# EAGLE design trs80_m2 (EAGLE 9.6.2)
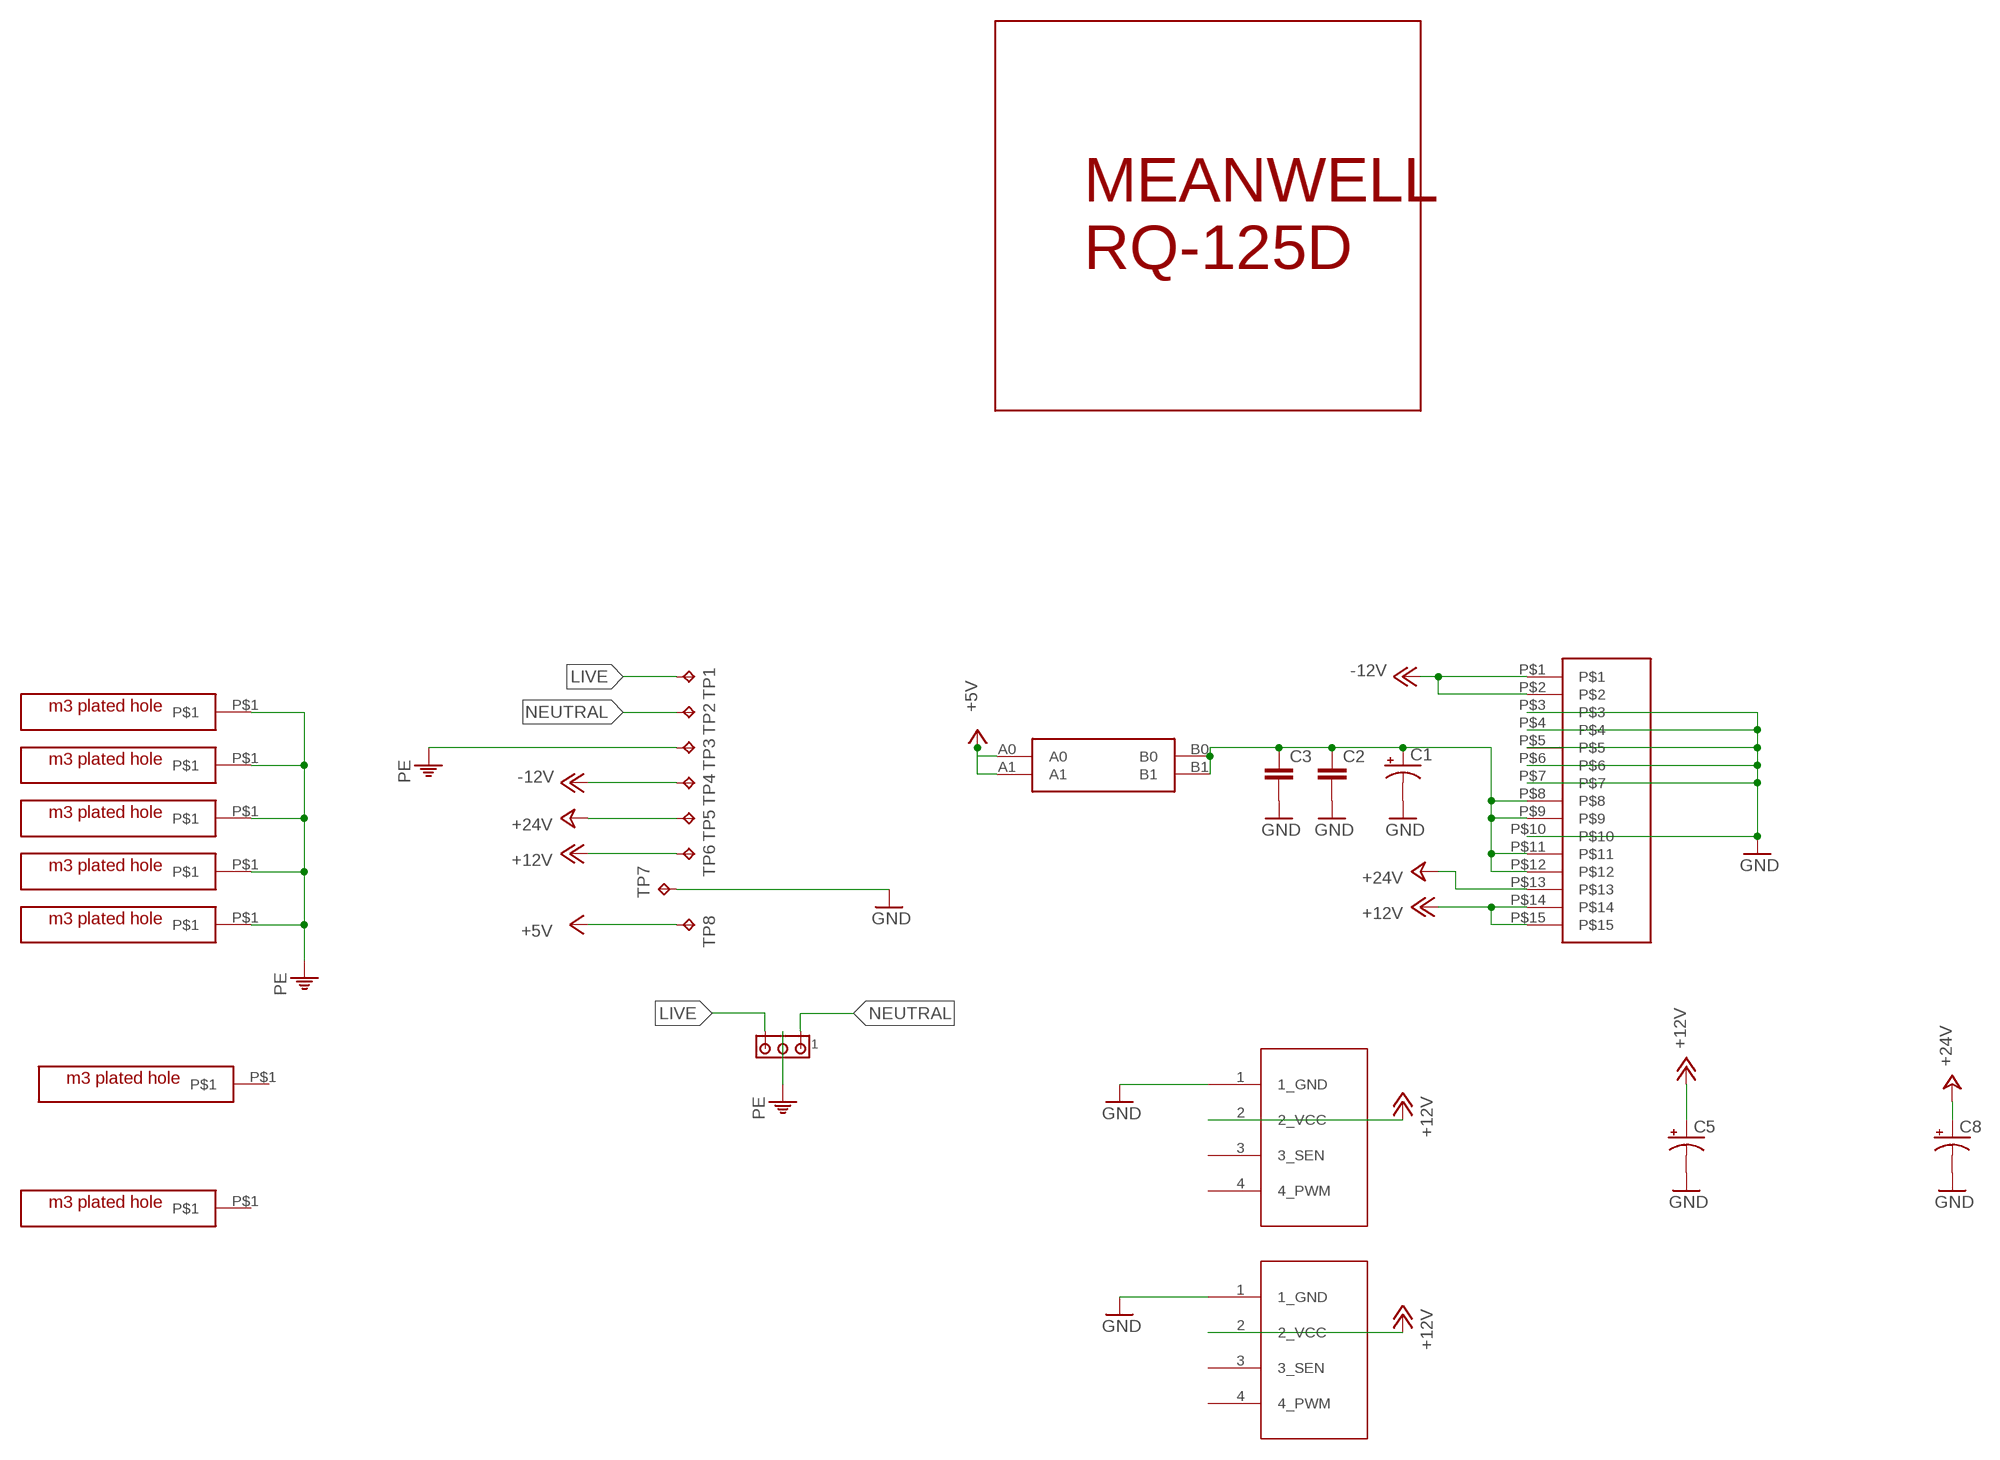
[diagram p0: schematic, sheet 1]

## Parts
C1  CPOL-USE3.5-8  [E3,5-8]
C2  C5/2.5  [C5B2.5]
C3  C5/2.5  [C5B2.5]
C5  CPOL-USE3.5-8  [E3,5-8]
C8  CPOL-USE3.5-8  [E3,5-8]
J1  350760-4  [350760-4]
JP1  4PIN_FAN  [1X04]
JP4  4PIN_FAN  [1X04]
TP1  TPPAD1-20Y  [P1-20Y]
TP2  TPPAD1-20Y  [P1-20Y]
TP3  TPPAD1-20Y  [P1-20Y]
TP4  TPPAD1-20Y  [P1-20Y]
TP5  TPPAD1-20Y  [P1-20Y]
TP6  TPPAD1-20Y  [P1-20Y]
TP7  TPPAD1-20Y  [P1-20Y]
TP8  TPPAD1-20Y  [P1-20Y]
U$2  MEANWELL_RQ_125D  [MEANWELL_RQ125D]
U$3  TE_3X5  [TRS80M2_3X5]
U$4  M3_HOLE_PLATED  [M3_HOLE_PLATED]
U$5  M3_HOLE_PLATED  [M3_HOLE_PLATED]
U$6  M3_HOLE_PLATED  [M3_HOLE_PLATED]
U$7  M3_HOLE_PLATED  [M3_HOLE_PLATED]
U$8  M3_HOLE_PLATED  [M3_HOLE_PLATED]
U$9  CAR_FUSE_HOLDER3IN1  [FUSE_HOLDER_3IN1]
U$10  M3_HOLE_PLATED  [M3_HOLE_PLATED]
U$11  M3_HOLE_PLATED  [M3_HOLE_PLATED]

## Nets
+5V: TP8.TP U$9.A0 U$9.A1
+12V: C5.+ JP1.2(2_VCC) JP4.2(2_VCC) TP6.TP U$3.P$14 U$3.P$15
+24V: C8.+ TP5.TP U$3.P$13
-12V: TP4.TP U$3.P$1 U$3.P$2
GND: C1.- C2.2 C3.2 C5.- C8.- JP1.1(1_GND) JP4.1(1_GND) TP7.TP U$3.P$3 U$3.P$4 U$3.P$5 U$3.P$6 U$3.P$7 U$3.P$10
LIVE: J1.3 TP1.TP
N$2: C1.+ C2.1 C3.1 U$3.P$8 U$3.P$9 U$3.P$11 U$3.P$12 U$9.B0 U$9.B1
NEUTRAL: J1.1 TP2.TP
PE: J1.2 TP3.TP U$4.P$1 U$5.P$1 U$6.P$1 U$7.P$1 U$8.P$1
Unconnected: JP1.3(3_SEN) JP1.4(4_PWM) JP4.3(3_SEN) JP4.4(4_PWM) U$10.P$1 U$11.P$1

## Library data of the parts
C1 C5 C8 = adafruit_changed:CPOL-US: POLARIZED CAPACITOR, American symbol
C2 C3 = capacitor-wima:C: CAPACITOR naming: grid - package width
J1 = con-amp:350760-4: Universal MATE-N-LOK .250" Centerline, 600 V, 19 - 36 A max Source: http://catalog.tycoelectronics.com/ .. ENG_CD_350760_T.pdf
JP1 JP4 = appleii:4PIN_FAN: PIN HEADER
TP1-TP8 = testpad:TP: Test pad
U$2 = os1:MEANWELL_RQ_125D
U$3 = os1:TE_3X5
U$4-U$8 U$10 U$11 = os1:M3_HOLE_PLATED
U$9 = atx_power_control:CAR_FUSE_HOLDER

## Board
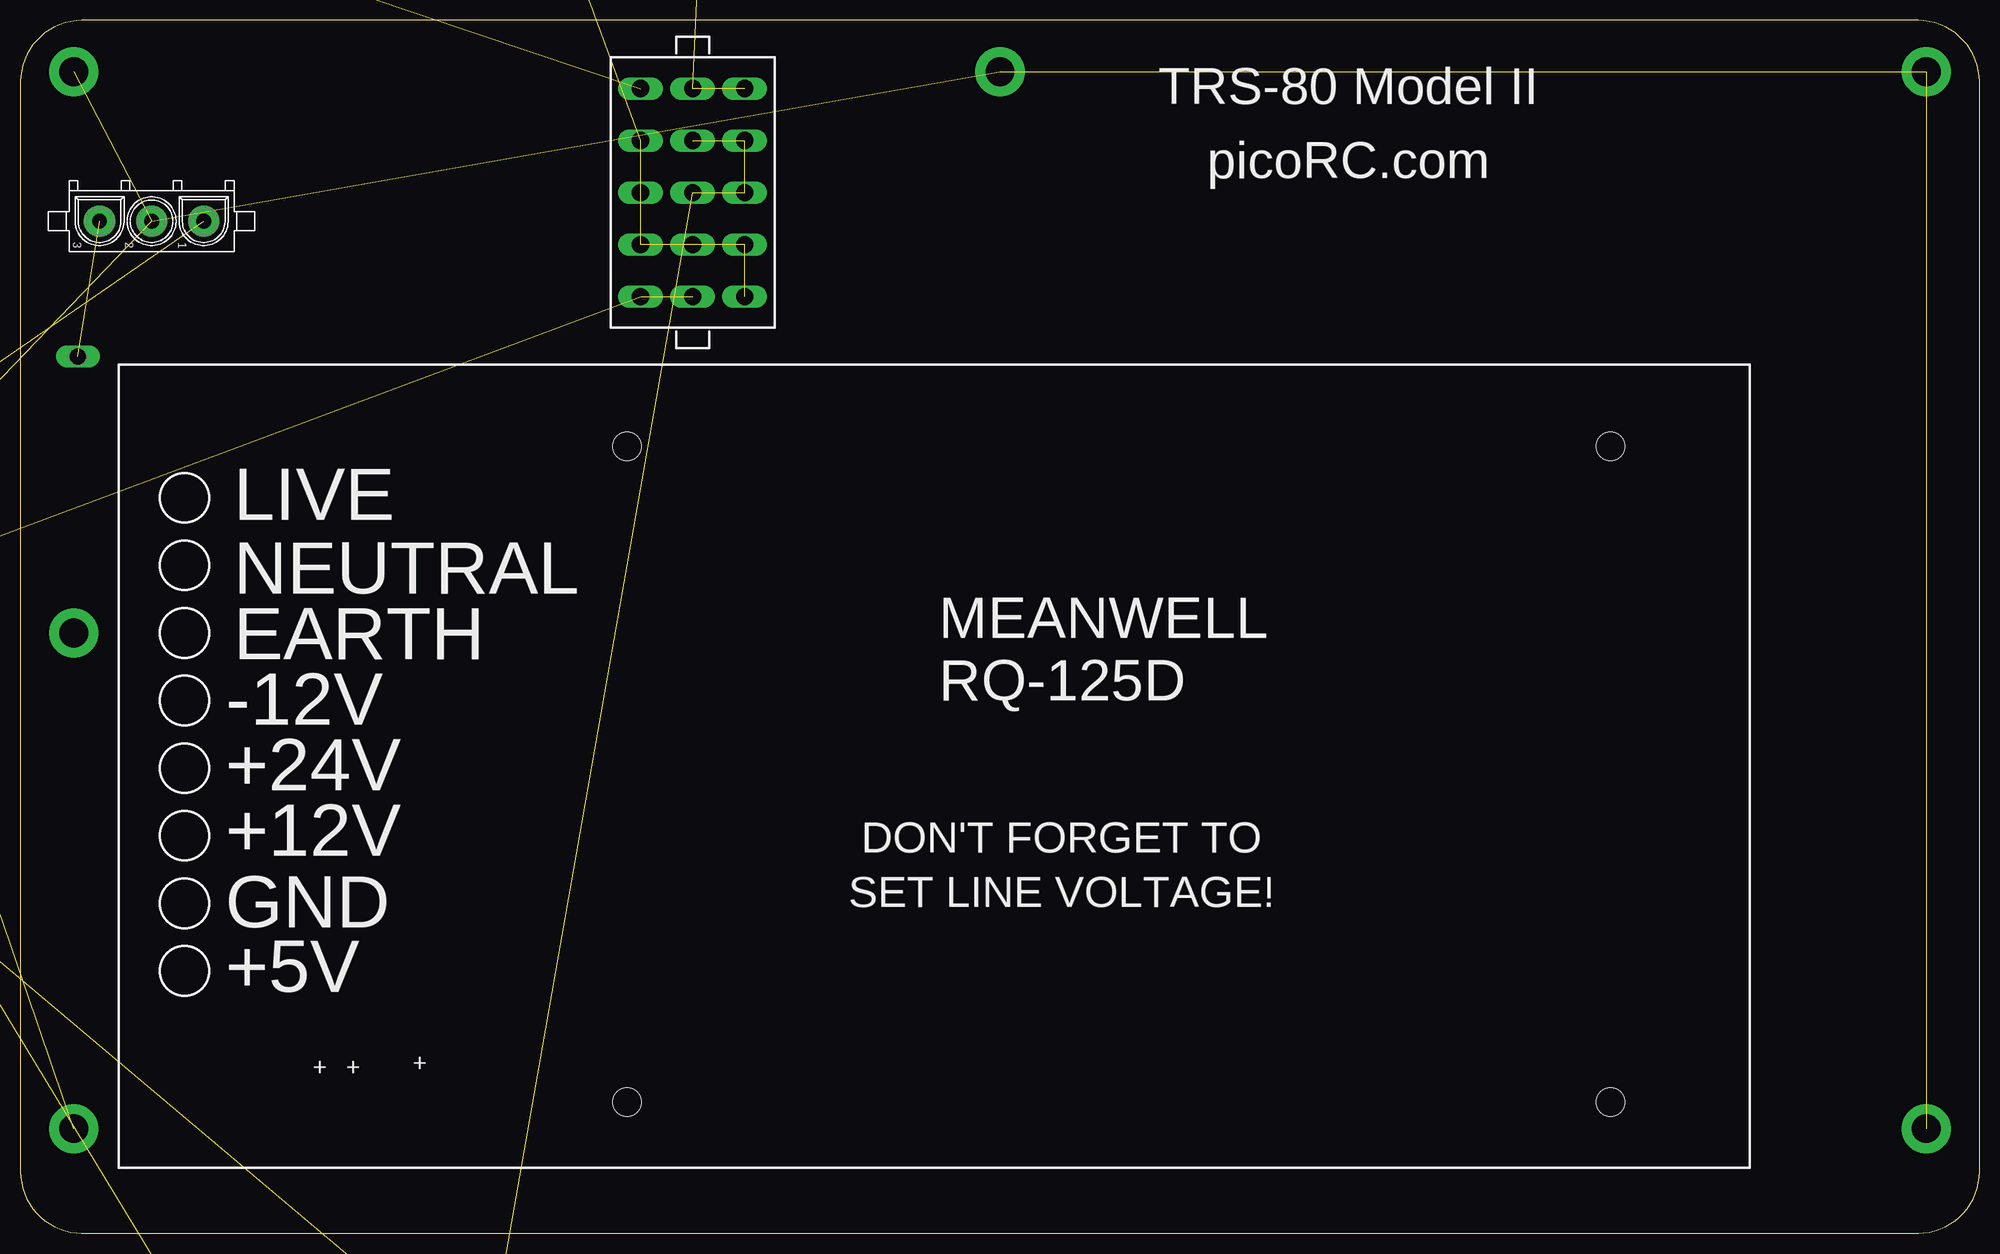
[diagram p1: board, top side]

Size 239 x 148 mm. Coordinates in mm from the lower left corner, seen from the top.
Outline: 7.5,0 231.5,0 arc90 239,7.5 239,140.5 arc90 231.5,148 7.5,148 arc90 0,140.5 0,7.5 arc90 7.5,0
Copper layers (1*16): Top 0.035mm / dielectric 1.5mm / Bottom 0.035mm
Design rules "deku_2layer_6mil *": minimum track width 6mil, minimum drill 15mil, track to track 20mil, track to pad 6mil, pad to pad 6mil, via to via 6mil, smd to smd 6mil, copper to edge 10mil, drill to drill 6mil, minimum pad ring 7mil, minimum via ring 7mil, stop-mask expansion 4mil, vias tented up to drill 25mil, thermal gap 10mil
tRestrict: area -2.5,85.3 to 57.5,153; area 35.6,19.8 to 240.9,154
Milling: area 79.2,172 to 80.5,179.2; area 99.5,170 to 100.8,177.2

### Footprints (pad centres in the part's own frame; a part is rotated, then mirrored left to right if it is on the bottom)
E3,5-8 = drill 0.813 pad 1.6: + -1.778,0 | drill 0.813 pad 1.6 octagon: - 1.778,0
C5B2.5 = drill 0.813 pad 1.6 octagon: 1 -2.54,0; 2 2.54,0
350760-4 = drill 1.8 pad 3.81: 1 -6.35,0; 2 0,0; 3 6.35,0
1X04 = drill 1.016 long: 1 -3.81,0; 2 -1.27,0; 3 1.27,0; 4 3.81,0
P1-20Y = drill 2.007 pad 2.54 long: TP 0,0
MEANWELL_RQ125D = hole 3.5: 62,8; 62,88; 182,8; 182,88
TRS80M2_3X5 = drill 2.1 pad 2.54 long: P$1 6.35,12.7; P$2 0,12.7; P$3 -6.35,12.7; P$4 6.35,6.35; P$5 0,6.35; P$6 -6.35,6.35; P$7 6.35,0; P$8 0,0; P$9 -6.35,0; P$10 6.35,-6.35; P$11 0,-6.35; P$12 -6.35,-6.35; P$13 6.35,-12.7; P$14 0,-12.7; P$15 -6.35,-12.7
M3_HOLE_PLATED = drill 3.5 pad 6: P$1 0,0
FUSE_HOLDER_3IN1 = drill 1.8: A0 -7.05,1.75; A1 -7.05,-1.75; B0 7.05,1.75; B1 7.05,-1.75

### Placement (x,y rotation side)
C1  45.5,-29 270 top  (outside the outline)
C2  37.5,-29 270 top  (outside the outline)
C3  33.5,-29 270 top  (outside the outline)
C5  -34,145.5 180 top  (outside the outline)
C8  -12,171 90 top  (outside the outline)
J1  16,123.5 180 top
JP1  85.5,187.5 0 top  (outside the outline)
JP4  61.5,182.5 0 top  (outside the outline)
TP1  7,107 90 top
TP2  -19,95 90 top  (outside the outline)
TP3  -19,87 90 top  (outside the outline)
TP4  -19,79 90 top  (outside the outline)
TP5  -19,71 90 top  (outside the outline)
TP6  -19,63 90 top  (outside the outline)
TP7  -19,55 90 top  (outside the outline)
TP8  -19,47 90 top  (outside the outline)
U$2  12,8 0 top
U$3  82,127 180 top
U$4  6.5,12.75 0 top
U$5  232.5,12.75 0 top
U$6  119.5,141.75 0 top
U$7  6.5,141.75 0 top
U$8  232.5,141.75 0 top
U$9  62,-29 180 top  (outside the outline)
U$10  6.5,73.25 0 top
U$11  -36,-27 0 top  (outside the outline)

### Tracks (layer width: path | path; a pad name or v marks a point on that pad's centre or on a via)
+5V  (2 unrouted)
+12V  (5 unrouted)
+24V  (2 unrouted)
-12V  (2 unrouted)
GND  (13 unrouted)
  pour Top (isolate 0.813): -6.5,164 -6.5,-16 244.5,-16 244.5,164
LIVE  (1 unrouted)
N$2  (8 unrouted)
NEUTRAL  (1 unrouted)
PE  (6 unrouted)

### Text on the board
tPlace: 25 OCT 2025 todo: / / earth via PSU metal case, make meanwell mounting hole plated through, ensure contact, in guide ask to confirm continuity of earth terminal and chassis, if no continuity use ground lug | PC FAN | L | N | E | 5V 7.5A | TRS-80 Model II / picoRC.com | + | + | + | + | + | + | + | 13 | 15 | 6 | 4 | +24 +12 +12 / GND +5 +5 / GND +5 +5 / GND GND GND / -12 -12 GND | 1 | 3